# Altium schematic sheet Supply.SchDoc: RFSoC AMC
size 420 x 297 mm; CompanyName: WUT; DrawnBy: T. Przywozki; Organization: WUT ISE; Address1: Warsaw University of Technology; Address2: Nowowiejska 15/19 00-665 Warsaw; Address3: Tomasz.Przywozki@pw.edu.pl; DocumentNumber: 21; Revision: 1; SheetNumber: 21; SheetTotal: 45; Project: RFSoC AMC; ModifiedBy: T. Przywozki; CreateDate: -; CheckedDate: -; DivGrp: ISE; Designer: T. Przywozki; ModifiedDate: -; ProjectName: ADC/DAC MEZZANINE
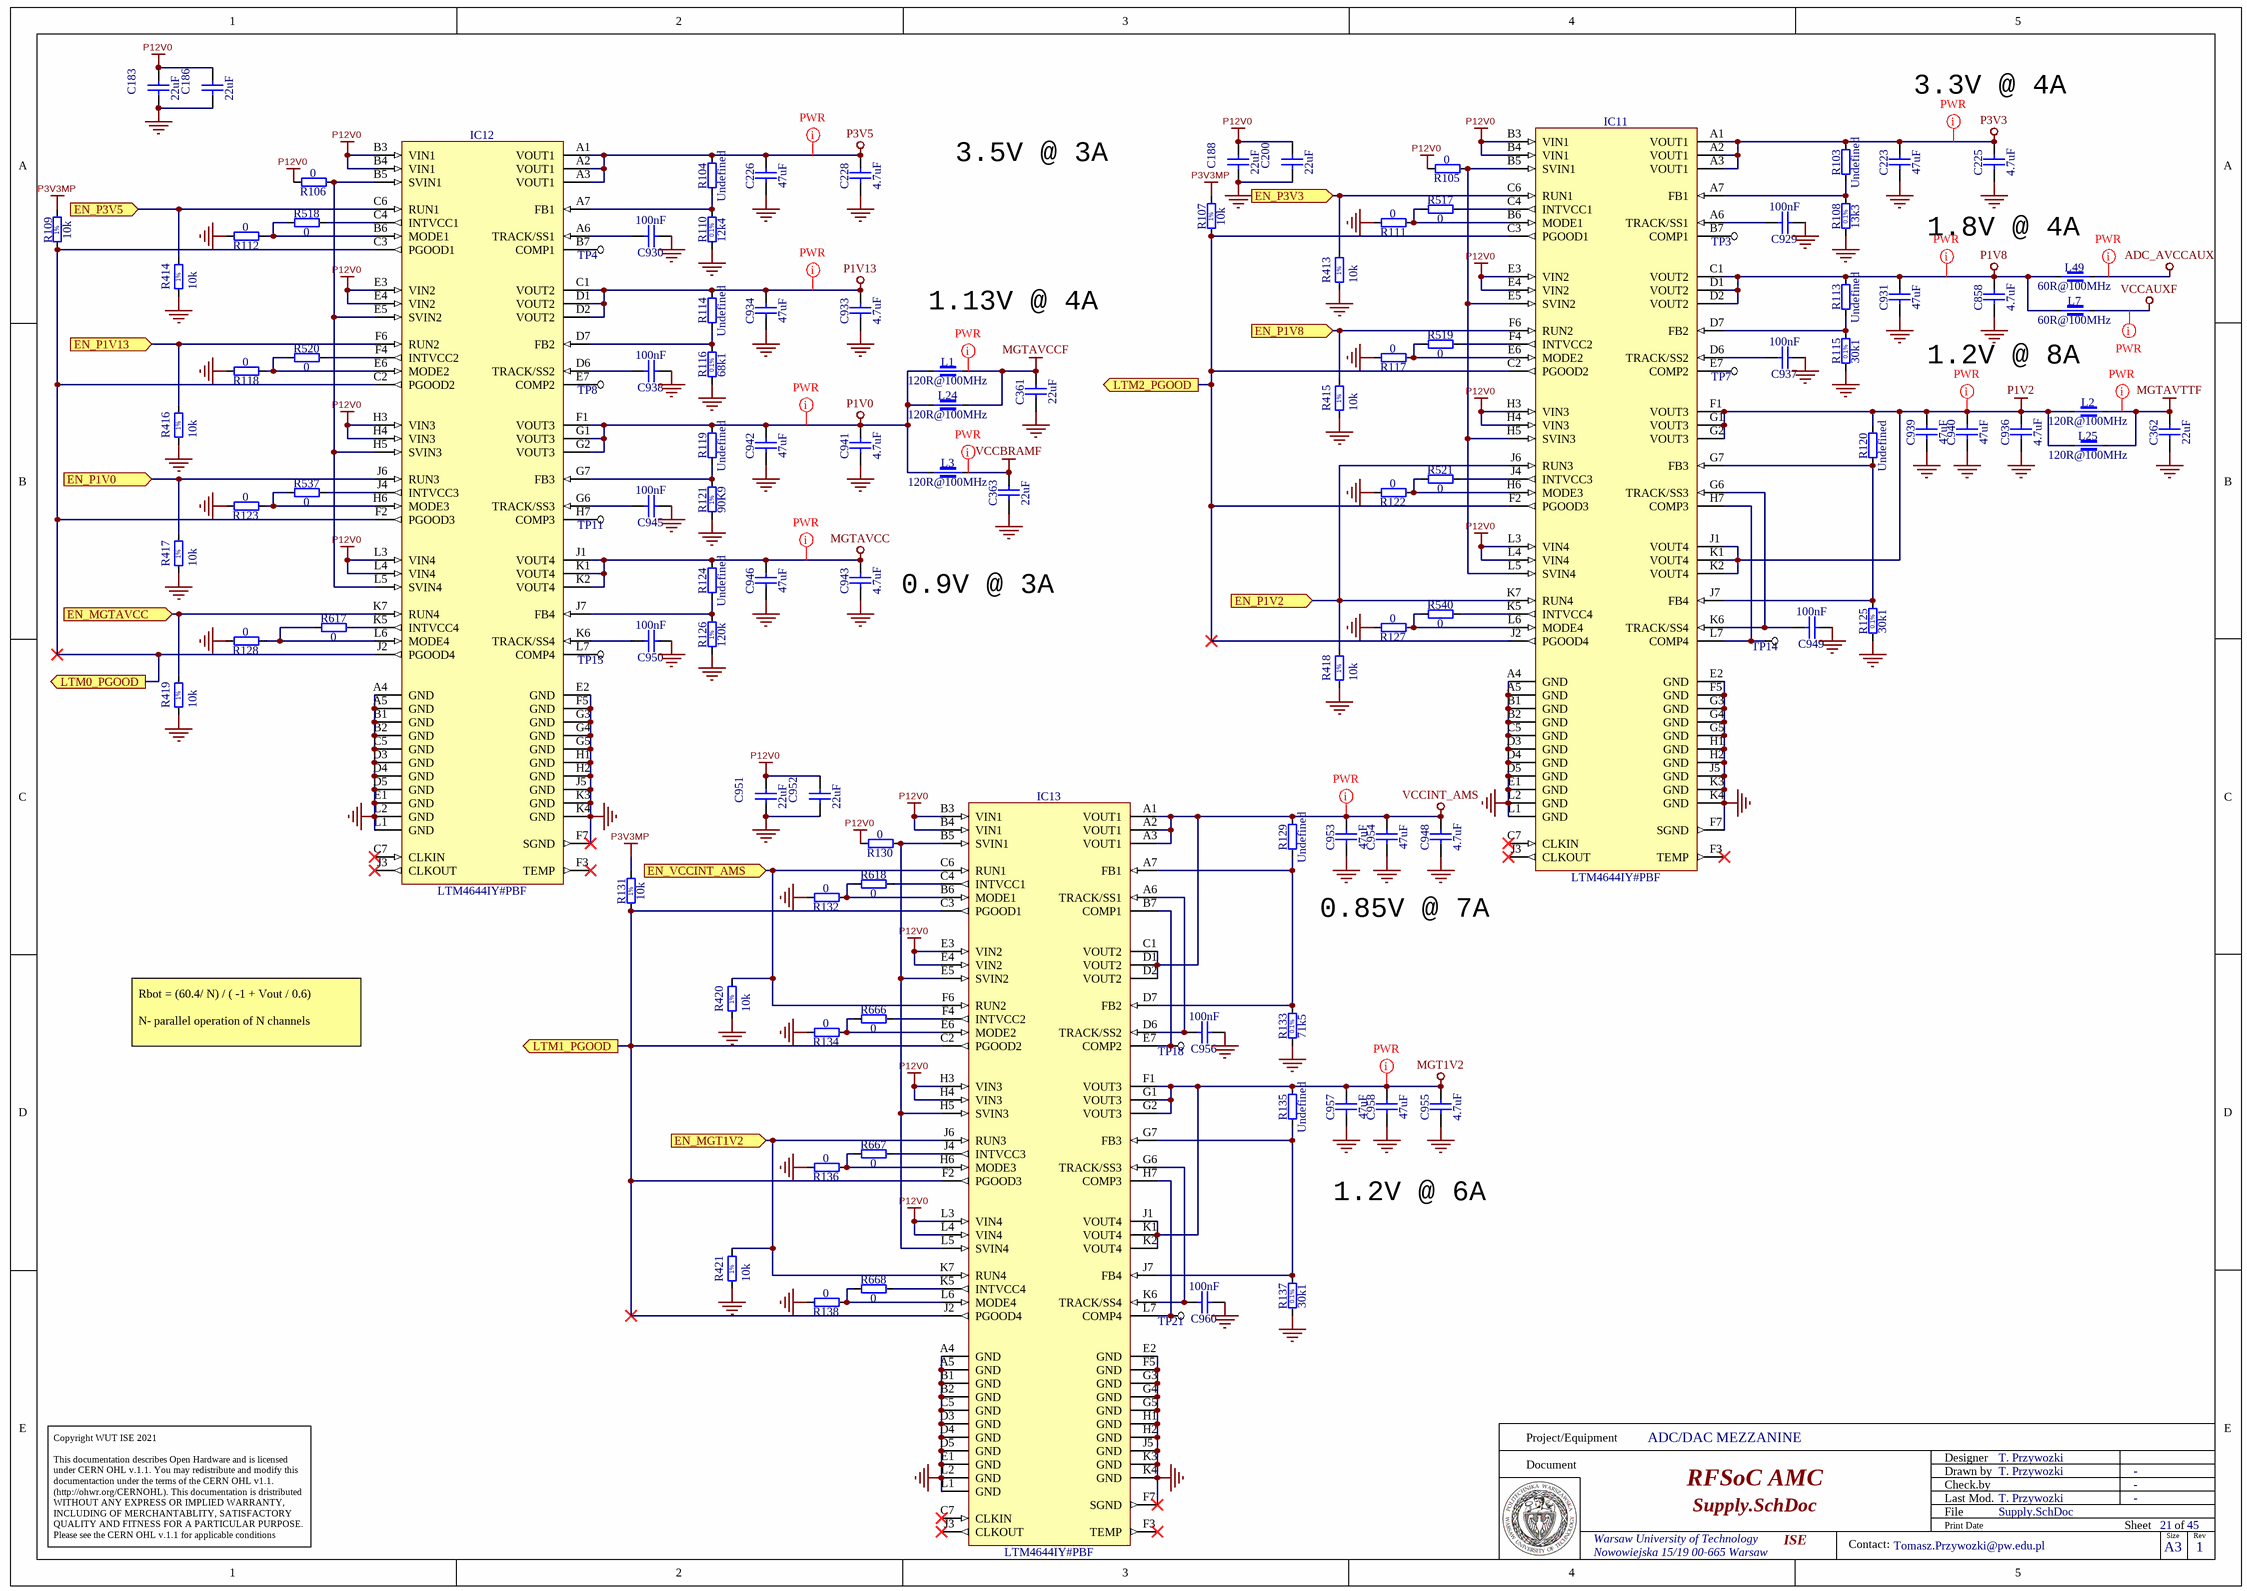
[diagram p0: Supply.SchDoc]

## Parts
C183  22uF  [CAPC2012X135N]
C186  22uF  [CAPC2012X135N]
C188  22uF  [CAPC2012X135N]
C200  22uF  [CAPC2012X135N]
C223  47uF  [CAPC2012X140N]
C225  4.7uF  [CAPC1709X95N]
C226  47uF  [CAPC2012X140N]
C228  4.7uF  [CAPC1709X95N]
C361  22uF  [CAPC1709X100N]
C362  22uF  [CAPC1709X100N]
C363  22uF  [CAPC1709X100N]
C858  4.7uF  [CAPC1709X95N]
C929  100nF  [CAPC1005X55N]
C930  100nF  [CAPC1005X55N]
C931  47uF  [CAPC2012X140N]
C933  4.7uF  [CAPC1709X95N]
C934  47uF  [CAPC2012X140N]
C936  4.7uF  [CAPC1709X95N]
C937  100nF  [CAPC1005X55N]
C938  100nF  [CAPC1005X55N]
C939  47uF  [CAPC2012X140N]
C940  47uF  [CAPC2012X140N]
C941  4.7uF  [CAPC1709X95N]
C942  47uF  [CAPC2012X140N]
C943  4.7uF  [CAPC1709X95N]
C945  100nF  [CAPC1005X55N]
C946  47uF  [CAPC2012X140N]
C948  4.7uF  [CAPC1709X95N]
C949  100nF  [CAPC1005X55N]
C950  100nF  [CAPC1005X55N]
C951  22uF  [CAPC2012X135N]
C952  22uF  [CAPC2012X135N]
C953  47uF  [CAPC2012X140N]
C954  47uF  [CAPC2012X140N]
C955  4.7uF  [CAPC1709X95N]
C956  100nF  [CAPC1005X55N]
C957  47uF  [CAPC2012X140N]
C958  47uF  [CAPC2012X140N]
C960  100nF  [CAPC1005X55N]
IC11  LTM4644IY#PBF  [BGA77C127P7X11_900X1500X521]
IC12  LTM4644IY#PBF  [BGA77C127P7X11_900X1500X521]
IC13  LTM4644IY#PBF  [BGA77C127P7X11_900X1500X521]
L1  120R@100MHz  [INDC1608X95N]
L2  120R@100MHz  [INDC1608X95N]
L3  120R@100MHz  [INDC1608X95N]
L7  60R@100MHz  [INDC4516X180N]
L24  120R@100MHz  [INDC1608X95N]
L25  120R@100MHz  [INDC1608X95N]
L49  60R@100MHz  [INDC4516X180N]
R103  Undefined  [RESC1608X55N]
R104  Undefined  [RESC1608X55N]
R105  0  [RESC1005X40N]
R106  0  [RESC1005X40N]
R107  10k  [RESC1005X40N]
R108  13k3  [RESC1608X55N]
R109  10k  [RESC1005X40N]
R110  12k4  [RESC1608X55N]
R111  0  [RESC1005X40N]
R112  0  [RESC1005X40N]
R113  Undefined  [RESC1608X55N]
R114  Undefined  [RESC1608X55N]
R115  30k1  [RESC1608X55N]
R116  68k1  [RESC1608X55N]
R117  0  [RESC1005X40N]
R118  0  [RESC1005X40N]
R119  Undefined  [RESC1608X55N]
R120  Undefined  [RESC1608X55N]
R121  90K9  [RESC1005X40N]
R122  0  [RESC1005X40N]
R123  0  [RESC1005X40N]
R124  Undefined  [RESC1608X55N]
R125  30k1  [RESC1608X55N]
R126  120k  [RESC1608X55N]
R127  0  [RESC1005X40N]
R128  0  [RESC1005X40N]
R129  Undefined  [RESC1608X55N]
R130  0  [RESC1005X40N]
R131  10k  [RESC1005X40N]
R132  0  [RESC1005X40N]
R133  71k5  [RESC1608X55N]
R134  0  [RESC1005X40N]
R135  Undefined  [RESC1608X55N]
R136  0  [RESC1005X40N]
R137  30k1  [RESC1608X55N]
R138  0  [RESC1005X40N]
R413  10k  [RESC1005X40N]
R414  10k  [RESC1005X40N]
R415  10k  [RESC1005X40N]
R416  10k  [RESC1005X40N]
R417  10k  [RESC1005X40N]
R418  10k  [RESC1005X40N]
R419  10k  [RESC1005X40N]
R420  10k  [RESC1005X40N]
R421  10k  [RESC1005X40N]
R517  0  [RESC1005X40N]
R518  0  [RESC1005X40N]
R519  0  [RESC1005X40N]
R520  0  [RESC1005X40N]
R521  0  [RESC1005X40N]
R537  0  [RESC1005X40N]
R540  0  [RESC1005X40N]
R617  0  [RESC1005X40N]
R618  0  [RESC1005X40N]
R666  0  [RESC1005X40N]
R667  0  [RESC1005X40N]
R668  0  [RESC1005X40N]
TP3  TP  [TP]  (value not drawn)
TP4  TP  [TP]  (value not drawn)
TP7  TP  [TP]  (value not drawn)
TP8  TP  [TP]  (value not drawn)
TP11  TP  [TP]  (value not drawn)
TP14  TP  [TP]  (value not drawn)
TP15  TP  [TP]  (value not drawn)
TP18  TP  [TP]  (value not drawn)
TP21  TP  [TP]  (value not drawn)

## Ports
EN_MGT1V2 (in), EN_MGTAVCC (in), EN_P1V0 (in), EN_P1V2 (in), EN_P1V8 (in), EN_P1V13 (in), EN_P3V3 (in), EN_P3V5 (in), EN_VCCINT_AMS (in), LTM0_PGOOD (out), LTM1_PGOOD (out), LTM2_PGOOD (out)

## Nets
ADC_AVCCAUX: L49.2
GND: C183.1 C186.1 C188.1 C200.1 C223.1 C225.1 C226.1 C228.1 C361.1 C362.1 C363.1 C858.1 C929.1 C930.1 C931.1 C933.1 C934.1 C936.1 C937.1 C938.1 C939.1 C940.1 C941.1 C942.1 C943.1 C945.1 C946.1 C948.1 C949.1 C950.1 C951.1 C952.1 C953.1 C954.1 C955.1 C956.1 C957.1 C958.1 C960.1 IC11.A4(GND) IC11.A5(GND) IC11.B1(GND) IC11.B2(GND) IC11.C5(GND) IC11.D3(GND) IC11.D4(GND) IC11.D5(GND) IC11.E1(GND) IC11.E2(GND) IC11.F5(GND) IC11.F7(SGND) IC11.G3(GND) IC11.G4(GND) IC11.G5(GND) IC11.H1(GND) IC11.H2(GND) IC11.J5(GND) IC11.K3(GND) IC11.K4(GND) IC11.L1(GND) IC11.L2(GND) IC12.A4(GND) IC12.A5(GND) IC12.B1(GND) IC12.B2(GND) IC12.C5(GND) IC12.D3(GND) IC12.D4(GND) IC12.D5(GND) IC12.E1(GND) IC12.E2(GND) IC12.F5(GND) IC12.F7(SGND) IC12.G3(GND) IC12.G4(GND) IC12.G5(GND) IC12.H1(GND) IC12.H2(GND) IC12.J5(GND) IC12.K3(GND) IC12.K4(GND) IC12.L1(GND) IC12.L2(GND) IC13.A4(GND) IC13.A5(GND) IC13.B1(GND) IC13.B2(GND) IC13.C5(GND) IC13.D3(GND) IC13.D4(GND) IC13.D5(GND) IC13.E1(GND) IC13.E2(GND) IC13.F5(GND) IC13.F7(SGND) IC13.G3(GND) IC13.G4(GND) IC13.G5(GND) IC13.H1(GND) IC13.H2(GND) IC13.J5(GND) IC13.K3(GND) IC13.K4(GND) IC13.L1(GND) IC13.L2(GND) R108.1 R110.1 R111.2 R112.2 R115.1 R116.1 R117.2 R118.2 R121.1 R122.2 R123.2 R125.1 R126.1 R127.2 R128.2 R132.2 R133.1 R134.2 R136.2 R137.1 R138.2 R413.1 R414.1 R415.1 R416.1 R417.1 R418.1 R419.1 R420.1 R421.1
MGT1V2: C955.2 C957.2 C958.2 IC13.F1(VOUT3) IC13.G1(VOUT3) IC13.G2(VOUT3) IC13.J1(VOUT4) IC13.K1(VOUT4) IC13.K2(VOUT4) R135.2
MGTAVCC: C943.2 C946.2 IC12.J1(VOUT4) IC12.K1(VOUT4) IC12.K2(VOUT4) R124.2
MGTAVCCF: C361.2 L1.2 L24.2
MGTAVTTF: C362.2 L2.2 L25.2
P1V0: C941.2 C942.2 IC12.F1(VOUT3) IC12.G1(VOUT3) IC12.G2(VOUT3) L1.1 L3.1 L24.1 R119.2
P1V2: C936.2 C939.2 C940.2 IC11.F1(VOUT3) IC11.G1(VOUT3) IC11.G2(VOUT3) IC11.J1(VOUT4) IC11.K1(VOUT4) IC11.K2(VOUT4) L2.1 L25.1 R120.2
P1V8: C858.2 C931.2 IC11.C1(VOUT2) IC11.D1(VOUT2) IC11.D2(VOUT2) L7.1 L49.1 R113.2
P1V13: C933.2 C934.2 IC12.C1(VOUT2) IC12.D1(VOUT2) IC12.D2(VOUT2) R114.2
P3V3: C223.2 C225.2 IC11.A1(VOUT1) IC11.A2(VOUT1) IC11.A3(VOUT1) R103.2
P3V3MP: R107.2 R109.2 R131.2
P3V5: C226.2 C228.2 IC12.A1(VOUT1) IC12.A2(VOUT1) IC12.A3(VOUT1) R104.2
P12V0: C183.2 C186.2 C188.2 C200.2 C951.2 C952.2 IC11.B3(VIN1) IC11.B4(VIN1) IC11.E3(VIN2) IC11.E4(VIN2) IC11.H3(VIN3) IC11.H4(VIN3) IC11.L3(VIN4) IC11.L4(VIN4) IC12.B3(VIN1) IC12.B4(VIN1) IC12.E3(VIN2) IC12.E4(VIN2) IC12.H3(VIN3) IC12.H4(VIN3) IC12.L3(VIN4) IC12.L4(VIN4) IC13.B3(VIN1) IC13.B4(VIN1) IC13.E3(VIN2) IC13.E4(VIN2) IC13.H3(VIN3) IC13.H4(VIN3) IC13.L3(VIN4) IC13.L4(VIN4) R105.2 R106.2 R130.2
VCCAUXF: L7.2
VCCBRAMF: C363.2 L3.2
VCCINT_AMS: C948.2 C953.2 C954.2 IC13.A1(VOUT1) IC13.A2(VOUT1) IC13.A3(VOUT1) IC13.C1(VOUT2) IC13.D1(VOUT2) IC13.D2(VOUT2) R129.2
EN_MGT1V2: IC13.J6(RUN3) IC13.K7(RUN4) R421.2 ; port EN_MGT1V2
EN_MGTAVCC: IC12.K7(RUN4) R419.2 ; port EN_MGTAVCC
EN_P1V0: IC12.J6(RUN3) R417.2 ; port EN_P1V0
EN_P1V2: IC11.J6(RUN3) IC11.K7(RUN4) R418.2 ; port EN_P1V2
EN_P1V8: IC11.F6(RUN2) R415.2 ; port EN_P1V8
EN_P1V13: IC12.F6(RUN2) R416.2 ; port EN_P1V13
EN_P3V3: IC11.C6(RUN1) R413.2 ; port EN_P3V3
EN_P3V5: IC12.C6(RUN1) R414.2 ; port EN_P3V5
EN_VCCINT_AMS: IC13.C6(RUN1) IC13.F6(RUN2) R420.2 ; port EN_VCCINT_AMS
LTM0_PGOOD: IC12.C2(PGOOD2) IC12.C3(PGOOD1) IC12.F2(PGOOD3) IC12.J2(PGOOD4) R109.1 ; port LTM0_PGOOD
LTM1_PGOOD: IC13.C2(PGOOD2) IC13.C3(PGOOD1) IC13.F2(PGOOD3) IC13.J2(PGOOD4) R131.1 ; port LTM1_PGOOD
LTM2_PGOOD: IC11.C2(PGOOD2) IC11.C3(PGOOD1) IC11.F2(PGOOD3) IC11.J2(PGOOD4) R107.1 ; port LTM2_PGOOD
NetC929_2: C929.2 IC11.A6(TRACK/SS1)
NetC930_2: C930.2 IC12.A6(TRACK/SS1)
NetC937_2: C937.2 IC11.D6(TRACK/SS2)
NetC938_2: C938.2 IC12.D6(TRACK/SS2)
NetC945_2: C945.2 IC12.G6(TRACK/SS3)
NetC949_2: C949.2 IC11.G6(TRACK/SS3) IC11.K6(TRACK/SS4)
NetC950_2: C950.2 IC12.K6(TRACK/SS4)
NetC956_2: C956.2 IC13.A6(TRACK/SS1) IC13.D6(TRACK/SS2)
NetC960_2: C960.2 IC13.G6(TRACK/SS3) IC13.K6(TRACK/SS4)
NetIC11_A7: IC11.A7(FB1) R103.1 R108.2
NetIC11_B5: IC11.B5(SVIN1) IC11.E5(SVIN2) IC11.H5(SVIN3) IC11.L5(SVIN4) R105.1
NetIC11_B6: IC11.B6(MODE1) R111.1 R517.1
NetIC11_B7: IC11.B7(COMP1) TP3.1
NetIC11_C4: IC11.C4(INTVCC1) R517.2
NetIC11_D7: IC11.D7(FB2) R113.1 R115.2
NetIC11_E6: IC11.E6(MODE2) R117.1 R519.1
NetIC11_E7: IC11.E7(COMP2) TP7.1
NetIC11_F4: IC11.F4(INTVCC2) R519.2
NetIC11_G7: IC11.G7(FB3) IC11.J7(FB4) R120.1 R125.2
NetIC11_H6: IC11.H6(MODE3) R122.1 R521.1
NetIC11_H7: IC11.H7(COMP3) IC11.L7(COMP4) TP14.1
NetIC11_J4: IC11.J4(INTVCC3) R521.2
NetIC11_K5: IC11.K5(INTVCC4) R540.2
NetIC11_L6: IC11.L6(MODE4) R127.1 R540.1
NetIC12_A7: IC12.A7(FB1) R104.1 R110.2
NetIC12_B5: IC12.B5(SVIN1) IC12.E5(SVIN2) IC12.H5(SVIN3) IC12.L5(SVIN4) R106.1
NetIC12_B6: IC12.B6(MODE1) R112.1 R518.1
NetIC12_B7: IC12.B7(COMP1) TP4.1
NetIC12_C4: IC12.C4(INTVCC1) R518.2
NetIC12_D7: IC12.D7(FB2) R114.1 R116.2
NetIC12_E6: IC12.E6(MODE2) R118.1 R520.1
NetIC12_E7: IC12.E7(COMP2) TP8.1
NetIC12_F4: IC12.F4(INTVCC2) R520.2
NetIC12_G7: IC12.G7(FB3) R119.1 R121.2
NetIC12_H6: IC12.H6(MODE3) R123.1 R537.1
NetIC12_H7: IC12.H7(COMP3) TP11.1
NetIC12_J4: IC12.J4(INTVCC3) R537.2
NetIC12_J7: IC12.J7(FB4) R124.1 R126.2
NetIC12_K5: IC12.K5(INTVCC4) R617.2
NetIC12_L6: IC12.L6(MODE4) R128.1 R617.1
NetIC12_L7: IC12.L7(COMP4) TP15.1
NetIC13_A7: IC13.A7(FB1) IC13.D7(FB2) R129.1 R133.2
NetIC13_B5: IC13.B5(SVIN1) IC13.E5(SVIN2) IC13.H5(SVIN3) IC13.L5(SVIN4) R130.1
NetIC13_B6: IC13.B6(MODE1) R132.1 R618.1
NetIC13_B7: IC13.B7(COMP1) IC13.E7(COMP2) TP18.1
NetIC13_C4: IC13.C4(INTVCC1) R618.2
NetIC13_E6: IC13.E6(MODE2) R134.1 R666.1
NetIC13_F4: IC13.F4(INTVCC2) R666.2
NetIC13_G7: IC13.G7(FB3) IC13.J7(FB4) R135.1 R137.2
NetIC13_H6: IC13.H6(MODE3) R136.1 R667.1
NetIC13_H7: IC13.H7(COMP3) IC13.L7(COMP4) TP21.1
NetIC13_J4: IC13.J4(INTVCC3) R667.2
NetIC13_K5: IC13.K5(INTVCC4) R668.2
NetIC13_L6: IC13.L6(MODE4) R138.1 R668.1

Not connected (* = marked no-connect by the designer): IC11 C7(CLKIN)* F3(TEMP)* J3(CLKOUT)*; IC12 C7(CLKIN)* F3(TEMP)* J3(CLKOUT)*; IC13 C7(CLKIN)* F3(TEMP)* J3(CLKOUT)*

## Layout directives
net class PWR: ADC_AVCCAUX, MGT1V2, MGTAVCC, MGTAVCCF, MGTAVTTF, P1V0, P1V2, P1V8, P1V13, P3V3, P3V5, VCCAUXF, VCCBRAMF, VCCINT_AMS

## Notes on the sheet
- 3.3V @ 4A
- 3.5V @ 3A
- 1.8V @ 4A
- 1.13V @ 4A
- 1.2V @ 8A
- (near C943) 0.9V @ 3A
- 0.85V @ 7A
- Rbot = (60.4/ N) / ( -1 + Vout / 0.6)
  N- parallel operation of N channels
- 1.2V @ 6A
- Project/Equipment
- Document
- Designer
- Drawn by
- Check.by
- Copyright WUT ISE 2021
  This documentation describes Open Hardware and is licensed under CERN OHL v.1.1. You may redistribute and modify this documentaction under the terms of the CERN OHL v1.1.
  (http://ohwr.org/CERNOHL). This documentation is dristributed WITHOUT ANY EXPRESS OR IMPLIED WARRANTY, INCLUDING OF MERCHANTABLITY, SATISFACTORY QUALITY AND FITNESS FOR A PARTICULAR PURPOSE. Please see the CERN OHL v.1.1 for applicable conditions
- File
- Last Mod.
- Print Date
- Sheet
- Size
- A3
- of
- Rev
- Contact:
- (in symbol R0402_10K_1%_0.0625W_100PPM) 1%
- (in symbol R0402_90K9_1%_0.0625W_100PPM) 1%
- (in symbol R0603_12K4_0.1%_0.063W_10PPM) 0.1%
- (in symbol R0603_13K3_0.1%_0.063W_10PPM) 0.1%
- (in symbol R0603_30K1_0.1%_0.063W_10PPM) 0.1%
- (in symbol R0603_68K1_0.1%_0.063W_10PPM) 0.1%
- (in symbol R0603_71K5_0.1%_0.063W_10PPM) 0.1%
- (in symbol R0603_120K_1%_0.1W_100PPM) 1%

## Library data of the parts
C183 C186 C188 C200 C951 C952 = CC0805_22UF_16V_10%_X5R: Non-polarised capacitor; Manufacturer: GENERIC; Part Description: SMD Multilayer Chip Ceramic Capacitor; Manufacturer1 Part Number: C2012X5R1C226KT; Tolerance: ±10%; Voltage: 16V; TC: X5R; Manufacturer Part Number: CC0805_22UF_16V_10%_X5R; Part Number: CC0805_22UF_16V_10%_X5R; Value: 22uF; Component Kind: Standard; Component Type: Standard; Pin Count: 2; Status: Preferred; Case: 0805; Mounted: Yes; Socket: No; SMD: Yes; Sense: No; Manufacturer1 Example: TDK; Manufacturer1 ComponentHeight: 1.35mm; HelpURL: \\cern.ch\dfs\Applications\Altium\Datasheets\CC0805_X5R_TDK_C.pdf; Author: CERN DEM JLC; CreateDate: 25.10.2012; LatestRevisionDate: 25.10.2012
C223 C226 C931 C934 C939 C940 C942 C946 C953 C954 C957 C958 = CC0805_47UF_6.3V_20%_X5R: Non-polarised capacitor; Manufacturer: GENERIC; Part Description: SMD Multilayer Chip Ceramic Capacitor; Manufacturer1 Part Number: C0805C476M9PACTU; Tolerance: ±20%; Voltage: 6.3V; TC: X5R; Manufacturer Part Number: CC0805_47UF_6.3V_20%_X5R; Part Number: CC0805_47UF_6.3V_20%_X5R; Value: 47uF; Component Kind: Standard; Component Type: Standard; Pin Count: 2; Status: Preferred; Case: 0805; Mounted: Yes; Socket: No; SMD: Yes; Sense: No; Manufacturer1 Example: KEMET; Manufacturer1 ComponentHeight: 1.4mm; HelpURL: \\cern.ch\dfs\Applications\Altium\Datasheets\CC0805_X5R_KEMET.pdf; Author: CERN DEM JLC; CreateDate: 16.10.2012; LatestRevisionDate: 16.10.2012
C225 C228 C858 C933 C936 C941 C943 C948 C955 = CC0603_4.7UF_16V_10%_X5R: Non-polarised capacitor; Manufacturer: GENERIC; Part Description: SMD Multilayer Chip Ceramic Capacitor; Manufacturer1 Part Number: EMK107ABJ475KA-T; Tolerance: ±10%; Voltage: 16V; TC: X5R; Manufacturer Part Number: CC0603_4.7UF_16V_10%_X5R; Part Number: CC0603_4.7UF_16V_10%_X5R; Value: 4.7uF; Component Kind: Standard; Component Type: Standard; Pin Count: 2; Status: None; Case: 0603; Mounted: Yes; Socket: No; SMD: Yes; Sense: No; Manufacturer1 Example: TAIYO YUDEN; Manufacturer1 ComponentHeight: 0.95mm; HelpURL: \\cern.ch\dfs\Applications\Altium\Datasheets\CC0603_X7R_TAIYO-YUDEN_HIGH-VALUE.pdf; Author: CERN DEM JLC; CreateDate: 16.12.2013; LatestRevisionDate: 16.09.2014
C361-C363 = CC0603_22UF_6.3V_20%_X5R: Non-polarised capacitor; Part Description: SMD Multilayer Chip Ceramic Capacitor; Manufacturer: GENERIC; Manufacturer1 Part Number: C1608X5R0J226M080AC; Voltage: 6.3V; TC: X5R; Tolerance: ±20%; Part Number: CC0603_22UF_6.3V_20%_X5R; Component Kind: Standard; Component Type: Standard; Pin Count: 2; Value: 22uF; Status: None; Manufacturer Part Number: CC0603_22UF_6.3V_20%_X5R; Case: 0603; Mounted: Yes; Socket: No; SMD: Yes; Sense: No; Manufacturer1 Example: TDK; Manufacturer1 ComponentHeight: 1mm; HelpURL: \\cern.ch\dfs\Applications\Altium\Datasheets\CC0603_X5R_TDK_C.pdf; Author: CERN DEM JLC; CreateDate: 16.12.2013; LatestRevisionDate: 13.09.2016
C929 C930 C937 C938 C945 C949 C950 C956 C960 = CC0402_100NF_16V_10%_X5R: Non-polarised capacitor; Part Description: SMD Multilayer Chip Ceramic Capacitor; Manufacturer: GENERIC; Manufacturer1 Part Number: GRM155R61C104KA88D; Voltage: 16V; TC: X5R; Tolerance: ±10%; Part Number: CC0402_100NF_16V_10%_X5R; Component Kind: Standard; Component Type: Standard; Pin Count: 2; Value: 100nF; Status: None; Manufacturer Part Number: CC0402_100NF_16V_10%_X5R; Case: 0402; Mounted: Yes; Socket: No; SMD: Yes; Sense: No; Manufacturer1 Example: MURATA; Manufacturer1 ComponentHeight: 0.55mm; HelpURL: \\cern.ch\dfs\Applications\Altium\Datasheets\CC0402_X5R_MURATA_GRM.pdf; Author: CERN DEM JLC; CreateDate: 10.12.2013; LatestRevisionDate: 10.12.2013
IC11-IC13 = LTM4644IY#PBF: Quad DC/DC µModule Regulator with Configurable 4A Output Array; Part Description: 4V-14V to 0.6V-5.5V Quad DC/DC uModule (Power Module) Regulator with Configurable 4A Output Array; Manufacturer: LINEAR TECHNOLOGY; PressFit: No; Bonding: No; Part Number: LTM4644IY#PBF; Component Kind: Standard; Component Type: Standard; Device: LTM4644IY#PBF; PackageDescription: BGA, 1.27mm Pitch, Rect.; 77 Pin, 7 Columns X 11 Rows, 9.00mm X 15.00mm X 5.21mm H; Manufacturer Part Number: LTM4644IY#PBF; Pin Count: 77; Case: BGA77; Mounted: Yes; Socket: No; SMD: Yes; Sense: No; ComponentHeight: 5.21mm; HelpURL: \\cern.ch\dfs\Applications\Altium\Datasheets\LTM4644IY#PBF.pdf; Author: CERN DEM JLC; CreateDate: 25.04.2018; LatestRevisionDate: 25.04.2018
L1-L3 L24 L25 = IND0603_MURATA_BLM18PG121SN1D: Manufacturer: MURATA; Part Description: SMD EMIFIL Chip Ferrite Bead; Power: 2A; Resistance: 0.05R; Case: 0603; ComponentHeight: 0.95mm; Manufacturer Part Number: BLM18PG121SN1D; Part Number: IND0603_MURATA_BLM18PG121SN1D; Pin Count: 2; SMD: Yes; Value: 120R@100MHz; Component Kind: Standard; Component Type: Standard; Status: None; Mounted: Yes; Socket: No; Sense: No; HelpURL: \\cern.ch\dfs\Applications\Altium\Datasheets\IND0603_MURATA_BLM18P.pdf; Author: CERN DEM BC; CreateDate: 27.07.2015; LatestRevisionDate: 25.10.2018
L7 L49 = IND1806_MURATA_BLM41PG600SN1L: Manufacturer: MURATA; Part Description: SMD EMI Suppression Chip Ferrite Bead (BLM41P Series); Power: 6A; Resistance: 0.01R; Manufacturer Part Number: BLM41PG600SN1L; Part Number: IND1806_MURATA_BLM41PG600SN1L; Value: 60R@100MHz; Component Kind: Standard; Component Type: Standard; Pin Count: 2; Status: None; Case: 1806; Mounted: Yes; Socket: No; SMD: Yes; Sense: No; ComponentHeight: 1.8mm; HelpURL: \\cern.ch\dfs\Applications\Altium\Datasheets\IND1806_MURATA_BLM41P.pdf; Author: CERN DEM JLC; CreateDate: 02.12.2009; LatestRevisionDate: 02.12.2009
R103 R104 R113 R114 R119 R120 R124 R129 R135 = R0603_NO-VALUE: Resistor; Part Description: Reserved Footprint For a 0603 (1608) Chip Resistor; PressFit: No; Mounted: No; Part Number: R0603_NO-VALUE; Component Kind: Standard; Component Type: Standard; Pin Count: 2; Value: Undefined; Status: None; Manufacturer: Undefined; Manufacturer Part Number: R0603_NO-VALUE; Case: 0603; Sense: No; Socket: No; SMD: Yes; Manufacturer1 Example: Undefined; Manufacturer1 Part Number: Undefined; Manufacturer1 ComponentHeight: Undefined; HelpURL: Undefined; Author: CERN DEM JLC; CreateDate: 03.12.2007; LatestRevisionDate: 13.03.2008
R105 R106 R111 R112 R117 R118 R122 R123 R127 R128 R130 R132 R134 R136 R138 R517-R521 R537 R540 R617 R618 R666-R668 = R0402_0R_JUMPER: Resistor; Manufacturer: GENERIC; Part Description: 1A (0.05R Max DC Resistance) Zero Ohm Jumper; Manufacturer1 Part Number: 232270591001L; PressFit: No; Manufacturer Part Number: R0402_0R_JUMPER; Part Number: R0402_0R_JUMPER; Value: 0; Component Kind: Standard; Component Type: Standard; Pin Count: 2; Status: Not Recommended; Case: 0402; Mounted: Yes; Sense: No; Socket: No; SMD: Yes; Manufacturer1 Example: YAGEO PHYCOMP; Manufacturer1 ComponentHeight: 0.4mm; HelpURL: \\cern.ch\dfs\Applications\Altium\Datasheets\R0402_Phycomp_RC0402.pdf; Author: CERN DEM JLC; CreateDate: 03.12.2007; LatestRevisionDate: 17.10.2012
R107 R109 R131 R413-R421 = R0402_10K_1%_0.0625W_100PPM: Resistor - 1%; Manufacturer: GENERIC; Part Description: General Purpose Thick Film Chip Resistor; Manufacturer1 Part Number: 232270671003L; TC: ±100ppm/°C; PressFit: No; Manufacturer Part Number: R0402_10K_1%_0.0625W_100PPM; Part Number: R0402_10K_1%_0.0625W_100PPM; Tolerance: ±1%; Value: 10k; Component Kind: Standard; Component Type: Standard; Pin Count: 2; Status: Not Recommended; Power: 0.0625W; Case: 0402; Mounted: Yes; Sense: No; Socket: No; SMD: Yes; Manufacturer1 Example: YAGEO PHYCOMP; Manufacturer1 ComponentHeight: 0.4mm; HelpURL: \\cern.ch\dfs\Applications\Altium\Datasheets\R0402_Phycomp_RC0402.pdf; Author: CERN DEM JLC
  R107 R109 R131: CreateDate: 03.12.2007; LatestRevisionDate: 17.10.2012
  R413-R421: CreateDate: 03/12/2007; LatestRevisionDate: 17/10/2012
R108 = R0603_13K3_0.1%_0.063W_10PPM: Resistor - 0.1%; Part Description: Thin Film Chip Resistor; Manufacturer: GENERIC; Manufacturer1 Part Number: RN73C1J13K3BTDF; Power: 0.063W; TC: ±10ppm; PressFit: No; Part Number: R0603_13K3_0.1%_0.063W_10PPM; Component Kind: Standard; Component Type: Standard; Pin Count: 2; Value: 13k3; Status: Not Recommended; Tolerance: ±0.1%; Manufacturer Part Number: R0603_13K3_0.1%_0.063W_10PPM; Case: 0603; Mounted: Yes; Sense: No; Socket: No; SMD: Yes; Manufacturer1 Example: TYCO HOLSWORTHY; Manufacturer1 ComponentHeight: 0.5mm; HelpURL: \\cern.ch\dfs\Applications\Altium\Datasheets\R0603_Tyco_RN73.pdf; Author: CERN DEM JLC; CreateDate: 03.12.2007; LatestRevisionDate: 13.03.2008
R110 = R0603_12K4_0.1%_0.063W_10PPM: Resistor - 0.1%; Part Description: Thin Film Chip Resistor; Manufacturer: GENERIC; Manufacturer1 Part Number: RN73C1J12K4BTDF; Power: 0.063W; TC: ±10ppm; PressFit: No; Part Number: R0603_12K4_0.1%_0.063W_10PPM; Component Kind: Standard; Component Type: Standard; Pin Count: 2; Value: 12k4; Status: Not Recommended; Tolerance: ±0.1%; Manufacturer Part Number: R0603_12K4_0.1%_0.063W_10PPM; Case: 0603; Mounted: Yes; Sense: No; Socket: No; SMD: Yes; Manufacturer1 Example: TYCO HOLSWORTHY; Manufacturer1 ComponentHeight: 0.5mm; HelpURL: \\cern.ch\dfs\Applications\Altium\Datasheets\R0603_Tyco_RN73.pdf; Author: CERN DEM JLC; CreateDate: 03.12.2007; LatestRevisionDate: 13.03.2008
R115 R125 R137 = R0603_30K1_0.1%_0.063W_10PPM: Resistor - 0.1%; Part Description: Thin Film Chip Resistor; Manufacturer: GENERIC; Manufacturer1 Part Number: RN73C1J30K1BTDF; Power: 0.063W; TC: ±10ppm; PressFit: No; Part Number: R0603_30K1_0.1%_0.063W_10PPM; Component Kind: Standard; Component Type: Standard; Pin Count: 2; Value: 30k1; Status: Not Recommended; Tolerance: ±0.1%; Manufacturer Part Number: R0603_30K1_0.1%_0.063W_10PPM; Case: 0603; Mounted: Yes; Sense: No; Socket: No; SMD: Yes; Manufacturer1 Example: TYCO HOLSWORTHY; Manufacturer1 ComponentHeight: 0.5mm; HelpURL: \\cern.ch\dfs\Applications\Altium\Datasheets\R0603_Tyco_RN73.pdf; Author: CERN DEM JLC; CreateDate: 03.12.2007; LatestRevisionDate: 13.03.2008
R116 = R0603_68K1_0.1%_0.063W_10PPM: Resistor - 0.1%; Part Description: Thin Film Chip Resistor; Manufacturer: GENERIC; Manufacturer1 Part Number: RN73C1J68K1BTDF; Power: 0.063W; TC: ±10ppm; PressFit: No; Part Number: R0603_68K1_0.1%_0.063W_10PPM; Component Kind: Standard; Component Type: Standard; Pin Count: 2; Value: 68k1; Status: Not Recommended; Tolerance: ±0.1%; Manufacturer Part Number: R0603_68K1_0.1%_0.063W_10PPM; Case: 0603; Mounted: Yes; Sense: No; Socket: No; SMD: Yes; Manufacturer1 Example: TYCO HOLSWORTHY; Manufacturer1 ComponentHeight: 0.5mm; HelpURL: \\cern.ch\dfs\Applications\Altium\Datasheets\R0603_Tyco_RN73.pdf; Author: CERN DEM JLC; CreateDate: 03.12.2007; LatestRevisionDate: 13.03.2008
R121 = R0402_90K9_1%_0.0625W_100PPM: Resistor - 1%; Part Description: General Purpose Thick Film Chip Resistor; Manufacturer: GENERIC; Manufacturer1 Part Number: CRCW040290K9FKED; TC: ±100ppm/°C; PressFit: No; Part Number: R0402_90K9_1%_0.0625W_100PPM; Component Kind: Standard; Component Type: Standard; Pin Count: 2; Value: 90K9; Status: Not Recommended; Power: 0.0625W; Tolerance: ±1%; Manufacturer Part Number: R0402_90K9_1%_0.0625W_100PPM; Case: 0402; Mounted: Yes; Sense: No; Socket: No; SMD: Yes; Manufacturer1 Example: VISHAY; Manufacturer1 ComponentHeight: 0.4mm; HelpURL: \\cern.ch\dfs\Applications\Altium\Datasheets\R0402_VISHAY_CRCW e3.pdf; Author: CERN DEM BC; CreateDate: 10.01.2020; LatestRevisionDate: 10.01.2020
R126 = R0603_120K_1%_0.1W_100PPM: Resistor - 1%; Part Description: General Purpose Thick Film Chip Resistor; Manufacturer: GENERIC; Manufacturer1 Part Number: NRC06F1203TRF; Power: 0.1W; TC: ±100ppm/°C; PressFit: No; Part Number: R0603_120K_1%_0.1W_100PPM; Component Kind: Standard; Component Type: Standard; Pin Count: 2; Value: 120k; Status: Preferred; Tolerance: ±1%; Manufacturer Part Number: R0603_120K_1%_0.1W_100PPM; Case: 0603; Mounted: Yes; Sense: No; Socket: No; SMD: Yes; Manufacturer1 Example: NIC COMPONENT; Manufacturer1 ComponentHeight: 0.55mm; HelpURL: \\cern.ch\dfs\Applications\Altium\Datasheets\R0603_NIC_NRC.pdf; Author: CERN DEM JLC; CreateDate: 03.12.2007; LatestRevisionDate: 13.03.2008
R133 = R0603_71K5_0.1%_0.063W_10PPM: Resistor - 0.1%; Part Description: Thin Film Chip Resistor; Manufacturer: GENERIC; Manufacturer1 Part Number: RN73C1J71K5BTDF; Power: 0.063W; TC: ±10ppm; PressFit: No; Part Number: R0603_71K5_0.1%_0.063W_10PPM; Component Kind: Standard; Component Type: Standard; Pin Count: 2; Value: 71k5; Status: Not Recommended; Tolerance: ±0.1%; Manufacturer Part Number: R0603_71K5_0.1%_0.063W_10PPM; Case: 0603; Mounted: Yes; Sense: No; Socket: No; SMD: Yes; Manufacturer1 Example: TYCO HOLSWORTHY; Manufacturer1 ComponentHeight: 0.5mm; HelpURL: \\cern.ch\dfs\Applications\Altium\Datasheets\R0603_Tyco_RN73.pdf; Author: CERN DEM JLC; CreateDate: 03.12.2007; LatestRevisionDate: 13.03.2008
TP3 TP4 TP7 TP8 TP11 TP14 TP15 TP18 TP21 = TP: Testpoint